# EAGLE schematic mcu_v052 (EAGLE 6.2)
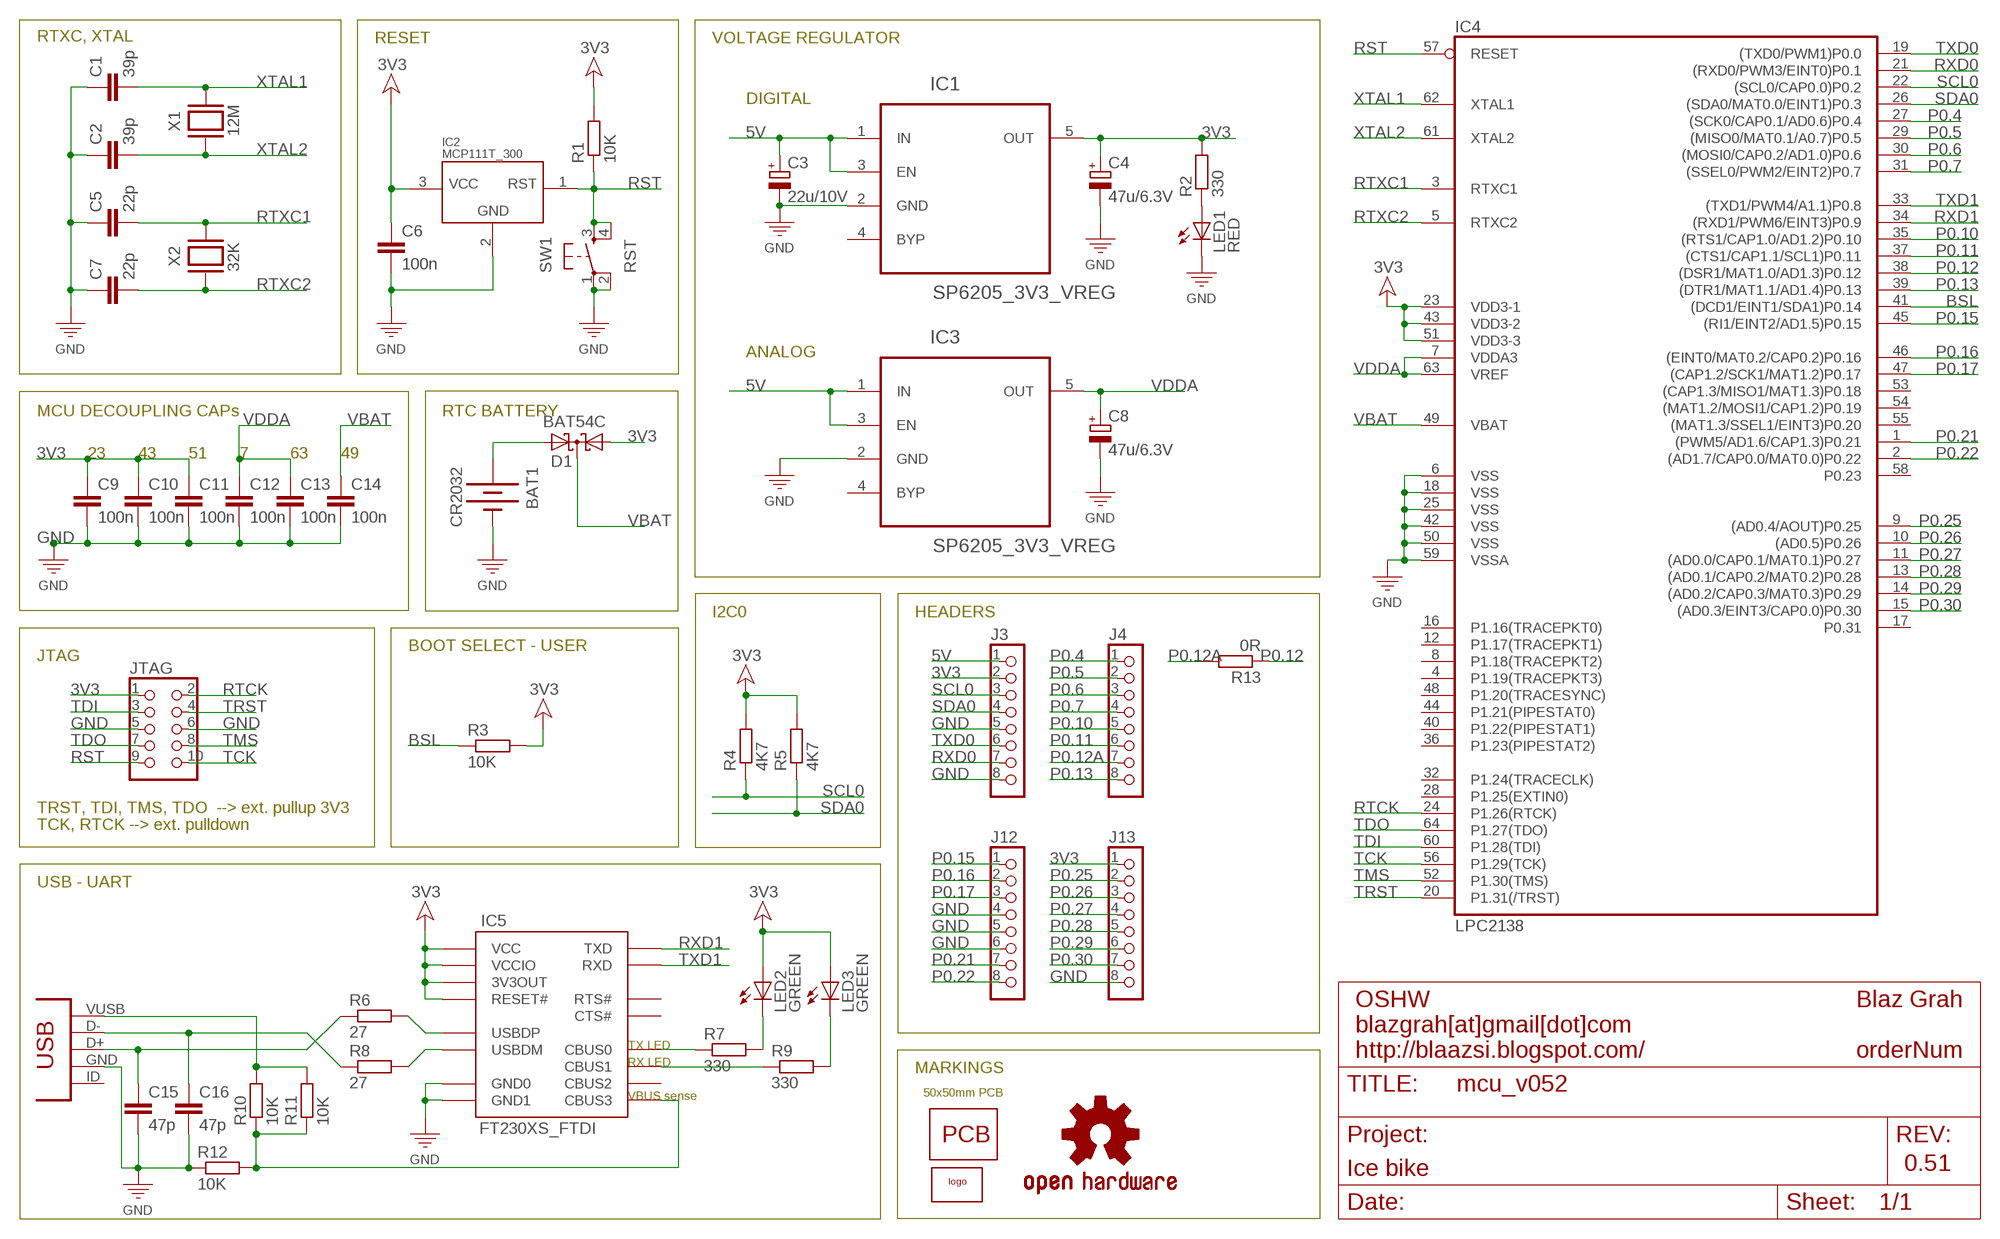
[diagram p0: schematic, sheet 1]

## Parts
BAT1  CR2032  BATTERY20MM  [BATTERY_20MM_SMD]
C1  39p  C-EUC0603  [C0603]
C2  39p  C-EUC0603  [C0603]
C3  22u/10V  CAPACITOR_POL-SMC_B  [SMC_B]
C4  47u/6.3V  CAPACITOR_POL-SMC_B  [SMC_B]
C5  22p  C-EUC0603  [C0603]
C6  100n  C-EUC0603  [C0603]
C7  22p  C-EUC0603  [C0603]
C8  47u/6.3V  CAPACITOR_POL-SMC_B  [SMC_B]
C9  100n  C-EUC0603  [C0603]
C10  100n  C-EUC0603  [C0603]
C11  100n  C-EUC0603  [C0603]
C12  100n  C-EUC0603  [C0603]
C13  100n  C-EUC0603  [C0603]
C14  100n  C-EUC0603  [C0603]
C15  47p  C-EUC0603  [C0603]
C16  47p  C-EUC0603  [C0603]
D1  BAT54C  [SOT23]
DOC  FRAME_DINA4_L  [DP_LOGO]
IC1  SP6205_3V3_VREG  [SOT23-5]
IC2  MCP111T_300  [SOT23]
IC3  SP6205_3V3_VREG  [SOT23-5]
IC4  LPC2138  LCP2138_LQFP64  [LQFP64]
IC5  FT230XS_FTDI  [SSOP16]
J3  CON_HEADER_1X08-PTH  [M1X8]
J4  CON_HEADER_1X08-PTH  [M1X8]
J12  CON_HEADER_1X08-PTH  [M1X8]
J13  CON_HEADER_1X08-PTH  [M1X8]
JTAG  CON_HEADER_2X05-PTH+SHROUDED_A  [PINSHRD_PTH_2X05]
LED1  RED  LED0805  [LED0805]
LED2  GREEN  LED0805  [LED0805]
LED3  GREEN  LED0805  [LED0805]
LOGO1  OSHW-LOGOS  [OSHW-LOGO-S]
PCB1  PCB  [PCB_50X50]
R1  10K  R-EU0603  [R0603]
R2  330  R-EU0603  [R0603]
R3  10K  R-EU0603  [R0603]
R4  4K7  R-EU0603  [R0603]
R5  4K7  R-EU0603  [R0603]
R6  27  R-EU0603  [R0603]
R7  330  R-EU0603  [R0603]
R8  27  R-EU0603  [R0603]
R9  330  R-EU0603  [R0603]
R10  10K  R-EU0603  [R0603]
R11  10K  R-EU0603  [R0603]
R12  10K  R-EU0603  [R0603]
R13  0R  R-EU0603J  [R0603_JUMP]
SW1  RST  TACTIL_BUTTON  [BUTTON_SW_4P_SMD]
U$13  LOGO  [LOGO_SMILE]
USB1  CON-USB-F-MINI-B  [CONN_USB_MINI-B]
X1  12M  CRYSTALSMD_4.8X10.6  [CRYSTAL_12M_4.8X10.6MM]
X2  32K  CRYSTALSMD_32K  [CRYSTAL_32K_SMD]

## Nets
3V3 [power]: C4.+ C6.1 C9.1 C10.1 C11.1 D1.1(A1) IC1.5(OUT) IC2.3(VCC) IC4.23(VDD3-1) IC4.43(VDD3-2) IC4.51(VDD3-3) IC5.P$3(VCCIO) IC5.P$10(3V3OUT) IC5.P$11(RESET#) IC5.P$12(VCC) J3.2 J13.1 JTAG.1 LED2.A LED3.A R1.2 R2.2 R3.2 R4.2 R5.2
5V [supply]: C3.+ IC1.1(IN) IC1.3(EN) IC3.1(IN) IC3.3(EN) J3.1
BSL: IC4.41((DCD1/EINT1/SDA1)P0.14) R3.1
GND [power]: BAT1.NEG C1.1 C2.1 C3.- C4.- C5.1 C6.2 C7.1 C8.- C9.2 C10.2 C11.2 C12.2 C13.2 C14.2 C15.2 C16.2 IC1.2(GND) IC2.2(GND) IC3.2(GND) IC4.6(VSS) IC4.18(VSS) IC4.25(VSS) IC4.42(VSS) IC4.50(VSS) IC4.59(VSSA) IC5.P$5(GND0) IC5.P$13(GND1) J3.5 J3.8 J12.4 J12.5 J12.6 J13.8 JTAG.5 JTAG.6 LED1.C R12.1 SW1.1 SW1.2 USB1.GND
N$4: LED1.A R2.1
N$5: BAT1.POS1(POZ) BAT1.POS2(POZ) D1.2(A2)
N$6: C16.1 R8.1 USB1.D-
N$7: C15.1 R6.1 USB1.D+
N$8: IC5.P$9(USBDM) R8.2
N$9: IC5.P$8(USBDP) R6.2
N$10: R10.2 R11.2 USB1.VUSB
N$11: IC5.P$16(CBUS3) R10.1 R11.1 R12.2
N$12: IC5.P$14(CBUS1) R9.1
N$13: LED2.C R7.2
N$14: LED3.C R9.2
N$15: IC5.P$15(CBUS0) R7.1
P0.4: IC4.27((SCK0/CAP0.1/AD0.6)P0.4) J4.1
P0.5: IC4.29((MISO0/MAT0.1/A0.7)P0.5) J4.2
P0.6: IC4.30((MOSI0/CAP0.2/AD1.0)P0.6) J4.3
P0.7: IC4.31((SSEL0/PWM2/EINT2)P0.7) J4.4
P0.10: IC4.35((RTS1/CAP1.0/AD1.2)P0.10) J4.5
P0.11: IC4.37((CTS1/CAP1.1/SCL1)P0.11) J4.6
P0.12: IC4.38((DSR1/MAT1.0/AD1.3)P0.12) R13.1
P0.12A: J4.7 R13.2
P0.13: IC4.39((DTR1/MAT1.1/AD1.4)P0.13) J4.8
P0.15: IC4.45((RI1/EINT2/AD1.5)P0.15) J12.1
P0.16: IC4.46((EINT0/MAT0.2/CAP0.2)P0.16) J12.2
P0.17: IC4.47((CAP1.2/SCK1/MAT1.2)P0.17) J12.3
P0.21: IC4.1((PWM5/AD1.6/CAP1.3)P0.21) J12.7
P0.22: IC4.2((AD1.7/CAP0.0/MAT0.0)P0.22) J12.8
P0.25: IC4.9((AD0.4/AOUT)P0.25) J13.2
P0.26: IC4.10((AD0.5)P0.26) J13.3
P0.27: IC4.11((AD0.0/CAP0.1/MAT0.1)P0.27) J13.4
P0.28: IC4.13((AD0.1/CAP0.2/MAT0.2)P0.28) J13.5
P0.29: IC4.14((AD0.2/CAP0.3/MAT0.3)P0.29) J13.6
P0.30: IC4.15((AD0.3/EINT3/CAP0.0)P0.30) J13.7
RST: IC2.1(RST) IC4.57(RESET) JTAG.9 R1.1 SW1.3 SW1.4
RTCK: IC4.24(P1.26(RTCK)) JTAG.2
RTXC1: C5.2 IC4.3(RTXC1) X2.X2
RTXC2: C7.2 IC4.5(RTXC2) X2.X1
RXD0: IC4.21((RXD0/PWM3/EINT0)P0.1) J3.7
RXD1: IC4.34((RXD1/PWM6/EINT3)P0.9) IC5.P$1(TXD)
SCL0: IC4.22((SCL0/CAP0.0)P0.2) J3.3 R4.1
SDA0: IC4.26((SDA0/MAT0.0/EINT1)P0.3) J3.4 R5.1
TCK: IC4.56(P1.29(TCK)) JTAG.10
TDI: IC4.60(P1.28(TDI)) JTAG.3
TDO: IC4.64(P1.27(TDO)) JTAG.7
TMS: IC4.52(P1.30(TMS)) JTAG.8
TRST: IC4.20(P1.31(/TRST)) JTAG.4
TXD0: IC4.19((TXD0/PWM1)P0.0) J3.6
TXD1: IC4.33((TXD1/PWM4/A1.1)P0.8) IC5.P$4(RXD)
VBAT: C14.1 D1.3(CC) IC4.49(VBAT)
VDDA [power]: C8.+ C12.1 C13.1 IC3.5(OUT) IC4.7(VDDA3) IC4.63(VREF)
XTAL1: C1.2 IC4.62(XTAL1) X1.P$2
XTAL2: C2.2 IC4.61(XTAL2) X1.P$1
Unconnected: IC1.4(BYP) IC3.4(BYP) IC4.4(P1.19(TRACEPKT3)) IC4.8(P1.18(TRACEPKT2)) IC4.12(P1.17(TRACEPKT1)) IC4.16(P1.16(TRACEPKT0)) IC4.17(P0.31) IC4.28(P1.25(EXTIN0)) IC4.32(P1.24(TRACECLK)) IC4.36(P1.23(PIPESTAT2)) IC4.40(P1.22(PIPESTAT1)) IC4.44(P1.21(PIPESTAT0)) IC4.48(P1.20(TRACESYNC)) IC4.53((CAP1.3/MISO1/MAT1.3)P0.18) IC4.54((MAT1.2/MOSI1/CAP1.2)P0.19) IC4.55((MAT1.3/SSEL1/EINT3)P0.20) IC4.58(P0.23) IC5.P$2(RTS#) IC5.P$6(CTS#) IC5.P$7(CBUS2) USB1.BODY@1(BODY) USB1.BODY@2(BODY) USB1.BODY@3(BODY) USB1.BODY@4(BODY) USB1.ID(USBID)

## Notes on the sheet
- RTXC, XTAL | RESET | VOLTAGE REGULATOR
- DIGITAL
- ANALOG
- MCU DECOUPLING CAPs | RTC BATTERY
- 23 | 43 | 51 | 7 | 63 | 49
- I2C0 | HEADERS
- BOOT SELECT - USER
- JTAG
- TRST, TDI, TMS, TDO  --> ext. pullup 3V3
- TCK, RTCK --> ext. pulldown
- USB - UART
- TX LED
- RX LED
- MARKINGS
- VBUS sense | 50x50mm PCB

## Library data of the parts
BAT1 = 00_beegee:BATTERY: BATTERY CONNECTORS
C1 C2 C5-C7 C9-C16 = 00_beegee:C-EU: CAPACITOR 22p ... 0603..... Farnell <http://si.farnell.com/multicomp/mcca000196/mlcc-0603-np0-50v-22pf/dp/1759057RL> ... 0.60€/100kom (dec. 2011) 100n .. 0603..... Farnell <http://si.farnell.com/multicomp/mcca000255/mlcc-0603-x7r-50v-100nf/dp/1759122> ... 0.60€/100kom (dec. 2011)
C3 C4 C8 = 10_dang_prototyps:CAPACITOR_POL: Polarized capacitor in various packages
D1 = diode:BAT54C: Schottky Diodes Source: Fairchild .. BAT54.pdf
DOC = 10_dang_prototyps:FRAME_DINA4_L: A4 DP frame Standard Dangerous Prototypes schematic frame. Automagically adds the DP logo and standard texts to the PCB Use the atrribute in the schematic editor to change the fields.; AUTHOR: Blaz Grah; DATE: 23.4.2012; LICENSE: OSHW; ORDER_NUM: orderNum; PROJECT: Ice bike; REV: 0.51; URL1: blazgrah[at]gmail[dot]com; URL2: http://blaazsi.blogspot.com/
IC1 IC3 = 01_farnell:SP6205_3V3_VREG; OC_FARNELL: 9388338; PACKAGE: SOT-23-5
IC2 = 00_beegee:MCP111T_300: Voltage supervissor Farnell: http://si.farnell.com/microchip/mcp111t-300e-tt/suppervisor-1ua-2-93v-sot-23b/dp/1605552RL 0,38€/1
IC4 = 00_beegee:LCP2138: NXP - LPC2138FBD64 32bit ARM7, 512k FLASH, LQFP64 ... Farnell <http://si.farnell.com/nxp/lpc2138fbd64/16-32bit-mcu-arm7-512k-flash-64lqfp/dp/1727704> ... 27.18€ (dec.2011)
IC5 = 01_farnell:FT230XS_FTDI: USB to UART http://si.farnell.com/ftdi/ft230xs/i-f-usb2-0-fs-to-basic-uart-16ssop/dp/2081321?Ntt=ft230xs 1.56€/1
J3 J4 J12 J13 = 10_dang_prototyps:CON_HEADER_1X08
JTAG = 10_dang_prototyps:CON_HEADER_2X05: 2x05 pin header
LED1-LED3 = 11_SparkFun:LED: LEDs Standard schematic elements and footprints for 5mm, 3mm, 1206, and 0603 sized LEDs. 5mm - Spark Fun Electronics SKU : COM-00529 (and others)
LOGO1 = 11_SparkFun:OSHW-LOGO: Open Source Hardware Logo This logo indicates the piece of hardware it is found on incorporates a OSHW license and/or adheres to the definition of open source hardware found here: http://freedomdefined.org/OSHW
PCB1 = 00_beegee:PCB: PCB size template
R1-R13 = 00_beegee:R-EU: RESISTOR Resistors: 10k ... 0603 ... Farnell <http://si.farnell.com/panasonic/erj3geyj103v/resistor-0603-10k-5-0-1w/dp/2059627> ... 0.40€/50kom (dec.2011)
SW1 = 00_beegee:TACTIL_BUTTON
U$13 = 00_beegee:LOGO
USB1 = 10_dang_prototyps:CON-USB-F: USB Female connector
X1 X2 = 00_beegee:CRYSTAL: CRYSTAL

## Net classes
0 default: width 0.254 mm, clearance 0.178 mm
1 power: width 0.254 mm, clearance 0.178 mm to class 0, clearance 0.178 mm
2 supply: width 0.381 mm, clearance 0.254 mm to class 0, clearance 0.254 mm to class 1, clearance 0.254 mm